# Altium schematic sheet Voltage_Buck_3A.SchDoc: =SheetTitle
size A4; SheetTitle: TPS51386 Buck Regulator; DrawnBy: Samyar Sadat Akhavi; DocumentNumber: 13; SheetNumber: 13; SheetTotal: 19
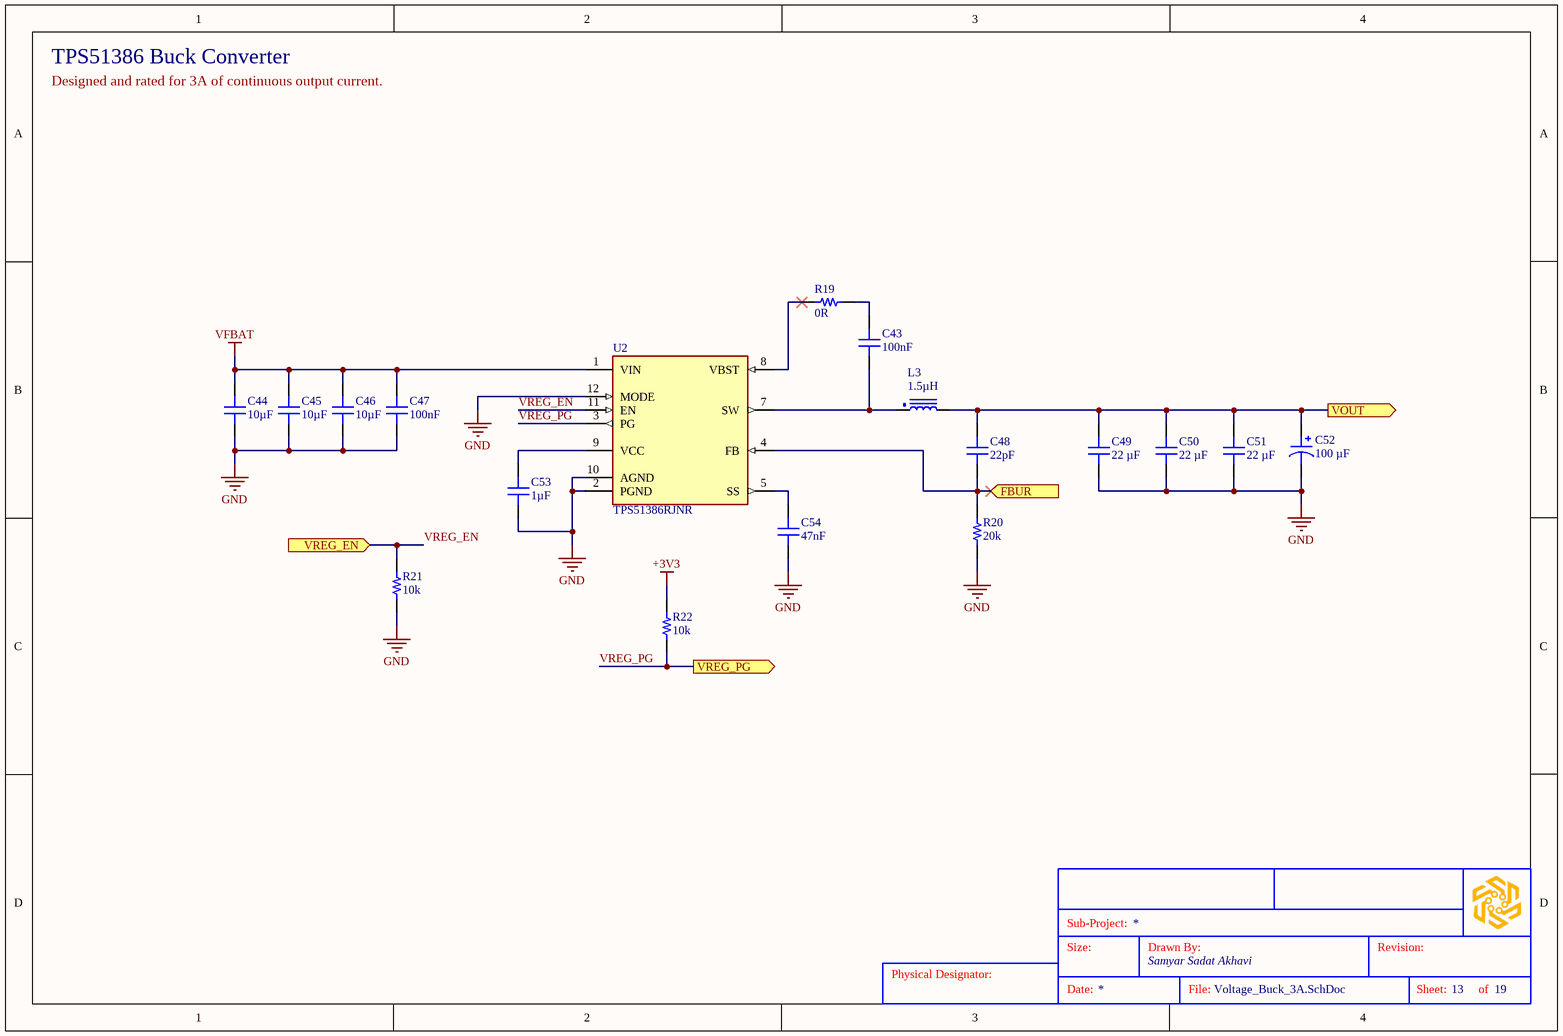
[diagram p0: Voltage_Buck_3A.SchDoc]

## Parts
?  (no value)  (graphical)
C43  100nF  [CAP 0603_1608]
C44  10µF  [CAP 1206_3216]
C45  10µF  [CAP 1206_3216]
C46  10µF  [CAP 1206_3216]
C47  100nF  [CAP 0603_1608]
C48  22pF  [CAP 0603_1608]
C49  22 µF  [CAP 1206_3216 - 0.8MM]
C50  22 µF  [CAP 1206_3216 - 0.8MM]
C51  22 µF  [CAP 1206_3216 - 0.8MM]
C52  100 µF  [CAP ALSMD 6.6MM H7.7MM]
C53  1µF  [CAP 0603_1608]
C54  47nF  [CAP 0603_1608]
GRAPH?  SGR-STDSDES  (value not drawn)  (graphical)
L3  1.5µH  [WE-HCC_807021]
R19  0R  [RES 0603_1608]
R20  20k  [RES 0603_1608]
R21  10k  [RES 0603_1608]
R22  10k  [RES 0603_1608]
U2  TPS51386RJNR  [VQFN-HR12_RJN_TEX]

## Ports
FBUR (in, see Voltage_Regulators[2D]), VOUT (out, see Voltage_Regulators[2D]), VREG_EN (in, see Voltage_Regulators[1D]), VREG_PG (out, see Voltage_Regulators[1D])

## Nets
+3V3: R22.1
GND: C44.1 C45.1 C46.1 C47.1 C49.1 C50.1 C51.1 C52.2 C53.1 C54.1 R20.1 R21.2 U2.2(PGND) U2.10(AGND) U2.12(MODE)
VFBAT: C44.2 C45.2 C46.2 C47.2 U2.1(VIN)
FBUR: C48.1 R20.2 U2.4(FB) ; port FBUR
VOUT: C48.2 C49.2 C50.2 C51.2 C52.1 L3.2 ; port VOUT
VREG_EN: R21.1 U2.11(EN) ; port VREG_EN
VREG_PG: R22.2 U2.3(PG) ; port VREG_PG
NetC43_1: C43.1 L3.1 U2.7(SW)
NetC43_2: C43.2 R19.2
NetC53_2: C53.2 U2.9(VCC)
NetC54_2: C54.2 U2.5(SS)
NetR19_1: R19.1 U2.8(VBST)

## Notes on the sheet
- TPS51386 Buck Converter
- Designed and rated for 3A of continuous output current.
- Sub-Project:
- Size:
- Drawn By:
- Revision:
- Date:
- File:
- Sheet:
- of
- (in symbol SGR-STDSDES) Physical Designator:

## Library data of the parts
? = SGR-STDTBSA4: STANDARD SCHEMATICS TITLE BLOCK
C43 C47 = GEN-CC100NT10V50KX7R603: GENERIC 0603 MLC CAPACITOR; Tolerance: ±10%; Voltage: 50V; Dielectric: X7R; Part Number: GEN-CC100NT10V50KX7R603; Value: 100nF
C44-C46 = GEN-CC10UT10V25KX7R1206: GENERIC 1206 MLC CAPACITOR; Tolerance: ±10%; Voltage: 25V; Dielectric: X7R; Part Number: GEN-CC10UT10V25KX7R1206; Value: 10µF
C48 = GEN-CC22PT10V16KX7R603: GENERIC 0603 MLC CAPACITOR; Tolerance: ±10%; Voltage: 16V; Dielectric: X7R; Part Number: GEN-CC22PT10V16KX7R603; Value: 22pF
C49-C51 = CL31A226KAHNNNE: CAP CER 22UF 25V X5R 1206; manufacturer: Samsung Electro-Mechanics; Tolerance: ±10%; Part Number: CL31A226KAHNNNE; Capacitance: 22 µF; Applications: General Purpose; componentlink1description: Datasheet; componentlink1url: http://www.samsungsem.com/kr/support/product-search/mlcc/CL31A226KAHNNNE.jsp; componentlink2description: DigiKey Link; componentlink2url: https://www.digikey.com/en/products/detail/samsung-electro-mechanics/CL31A226KAHNNNE/3888705; Device Package: 1206 (3216 Metric); lastupdated: 4/6/2026 7:37:25 PM; Lifecycle Status: Active; Minimum Order: 1; Mounting Type: Surface Mount, MLCC; Operating Temperature: -55°C ~ 85°C; Package / Case: 1206 (3216 Metric); packaging: TapeAndReel; partid: 22185; Part Status: Active; price: 0.06; series: CL; Size / Dimension: 0.126" L x 0.063" W (3.20mm x 1.60mm); Supplier 1: DigiKey; Supplier Part Number 1: 1276-3047-1-ND; Temperature Coefficient: X5R; Thickness (Max): 0.071" (1.80mm); value: 22 µF; Voltage - Rated: 25V
C52 = 865080445010: CAP ALUM 100UF 20% 25V SMD; manufacturer: Würth Elektronik; Impedance: 380 mOhms; Lifetime @ Temp.: 2000 Hrs @ 105°C; Polarization: Polar; Ripple Current @ High Frequency: 290 mA @ 100 kHz; Ripple Current @ Low Frequency: 188.5 mA @ 120 Hz; Surface Mount Land Size: 0.260" L x 0.260" W (6.60mm x 6.60mm); Part Number: 865080445010; Applications: General Purpose; Capacitance: 100 µF; componentlink1description: Datasheet; componentlink1url: https://katalog.we-online.de/pbs/datasheet/865080445010.pdf; componentlink2description: DigiKey Link; componentlink2url: https://www.digikey.com/en/products/detail/würth-elektronik/865080445010/5728033; Device Package: Radial, Can - SMD; Height - Seated (Max): 0.303" (7.70mm); lastupdated: 4/5/2026 8:54:41 PM; Lifecycle Status: Active; Minimum Order: 1; Mounting Type: Surface Mount; Operating Temperature: -55°C ~ 105°C; Package / Case: Radial, Can - SMD; packaging: TapeAndReel; partid: 8228; Part Status: Active; price: 0.16; series: WCAP-ASLI; Size / Dimension: 0.248" Dia (6.30mm); Supplier 1: DigiKey; Supplier Part Number 1: 732-8438-1-ND; Tolerance: ±20%; value: 100 µF; Voltage - Rated: 25 V
C53 = GEN-CC1UT10V25KX7R603: GENERIC 0603 MLC CAPACITOR; Tolerance: ±10%; Voltage: 25V; Dielectric: X7R; Part Number: GEN-CC1UT10V25KX7R603; Value: 1µF
C54 = GEN-CC47NT5V25KX7R603: GENERIC 0603 MLC CAPACITOR; Tolerance: ±5%; Voltage: 25V; Dielectric: X7R; Part Number: GEN-CC47NT5V25KX7R603; Value: 47nF
GRAPH? = SGR-STDSDES: STANDARD SHEET SYMBOL DESIGNATOR MARKING; Part Number: SGR-STDSDES
L3 = 7443340150: FIXED IND 1.5UH 16.5A 5.6 MOHM; Manufacturer: Würth Elektronik; Tolerance: ±20%; Saturation Current: 18.5A; Part Number: 7443340150; Value: 1.5µH; Current Rating: 16.5A; DC Resistance: 5.6mOhm; Supplier 1: DigiKey; Supplier Part Number 1: 732-2163-1-ND
R19 = GEN-CRR0603: GENERIC 0603 CHIP RESISTOR (JUMPER); Part Number: GEN-CRR0603; Value: 0R
R20 = GEN-CRR20KT1P8603: GENERIC 0603 CHIP RESISTOR; Tolerance: ±1%; Power: 0.125W; Part Number: GEN-CRR20KT1P8603; Value: 20k
R21 R22 = GEN-CRR10KT1P8603: GENERIC 0603 CHIP RESISTOR; Tolerance: ±1%; Power: 0.125W; Part Number: GEN-CRR10KT1P8603; Value: 10k
U2 = TPS51386RJNR: IC REG BUCK ADJ 8A 12VQFN; Manufacturer: Texas Instruments; Copyright: Copyright (C) 2026 Ultra Librarian. All rights reserved.; Part Number: TPS51386RJNR; Supplier 1: DigiKey; Supplier Part Number 1: 296-TPS51386RJNRCT-ND